# EAGLE design hackathon_trophy (EAGLE 8.3.0)
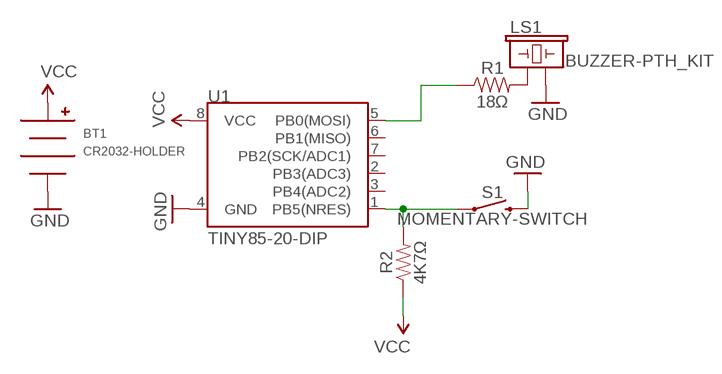
[diagram p0: schematic, sheet 1]

## Parts
BT1  CR2032-HOLDER  [CH28-2032LF]
LS1  BUZZER-PTH_KIT  [BUZZER-12MM-KIT]
R1  18Ω  RESISTOR1206  [1206]
R2  4K7Ω  RESISTOR1206  [1206]
S1  MOMENTARY-SWITCH  MOMENTARY-SWITCH-SPST-PTH-6.0MM-KIT  [TACTILE_SWITCH_PTH_6.0MM_KIT]
U1  TINY85-20-DIP  ATTINY45TINY85-20-DIP  [DIP08_MCU]

## Nets
GND: BT1.NEG LS1.- S1.3 U1.4(GND)
N$3: R2.2 S1.1 U1.1(PB5(NRES))
N$4: LS1.+ R1.2
N$5: R1.1 U1.5(PB0(MOSI))
VCC: BT1.POS R2.1 U1.8(VCC)
Unconnected: U1.2(PB3(ADC3)) U1.3(PB4(ADC2)) U1.6(PB1(MISO)) U1.7(PB2(SCK/ADC1))

## Library data of the parts
BT1 = battery-holder:CR2032-HOLDER
LS1 = SparkFun-Electromechanical:BUZZER: Buzzer Small round buzzers that operate around the audible 2kHz range. You can use these as speakers to create simple music or user interfaces. Variant Overview: PTH - Mini Speaker - PC Mount 12mm 2.048kHz <https://www.sparkfun.com/products/7950> PTH_KIT - Mini Speaker - PC Mount 12mm 2.048kHz <https://www.sparkfun.com/products/7950> KIT simplifies soldering by adding stop mask to one side of the pads. PTH_NO_SILK - Mini Speaker - PC Mount 12mm 2.048kHz <https://www.sparkfun.com/products/7950> No silkscreen indicator of buzzer outline. PTH_KIT_NO_SILK - Mini Speaker - PC Mount 12mm 2.048kHz <https://www.sparkfun.com/products/7950> KIT package w/o silkscreen SMD - Buzzer Audio Magnetic (CCV-084B16) SMD buzzer used on, e.g. the LilyPad Buzzer <https://www.sparkfun.com/products/8463> and RFID USB Reader <https://www.sparkfun.com/products/9963>. SMD_KIT - Buzzer Audio Magnetic (CCV-084B16) SMD Buzzer with elongated pins to make soldering easier. Used on the SparkFun Simon Says - Surface Mount Soldering Kit <https://www.sparkfun.com/products/10935>.; PROD_ID: COMP-08253; SF_SKU: COM-07950
R1 R2 = SparkFun-Resistors:RESISTOR: Generic Resistor Package
S1 = SparkFun-Switches:MOMENTARY-SWITCH-SPST: Momentary Switch (Pushbutton) - SPST Normally-open (NO) SPST momentary switches (buttons, pushbuttons). Variants PTH-12MM - 12mm square, through-hole Momentary Pushbutton Switch - 12mm Square <https://www.sparkfun.com/products/9190> (COM-09190) PTH-6.0MM, PTH-6.0MM-KIT - 6.0mm square, through-hole Mini Pushbutton Switch <https://www.sparkfun.com/products/97> (COM-00097) KIT package intended for soldering kit's - only one side of pads' copper is exposed. PTH-RIGHT-ANGLE-KIT - Right-angle, through-hole Right Angle Tactile Button <https://www.sparkfun.com/products/10791> - Used on SparkFun BigTime Watch Kit <https://www.sparkfun.com/products/11734> SMD-12MM - 12mm square, surface-mount Tactile Button - SMD (12mm) <https://www.sparkfun.com/products/12993> (COM-12993) Used on SparkFun PicoBoard <https://www.sparkfun.com/products/11888> SMD-4.5MM - 4.5mm Square Trackball Switch Used on SparkFun Blackberry Trackballer Breakout <https://www.sparkfun.com/products/13169> SMD-4.6MMX2.8MM - 4.60mm x 2.80mm, surface mount Used on SparkFun SAMD21 Mini Breakout <https://www.sparkfun.com/products/13664> SMD-5.2MM, SMD-5.2-REDUNDANT - 5.2mm square, surface-mount Mini Pushbutton Switch - SMD <https://www.sparkfun.com/products/8720> (COM-08720) Used on Arduino Pro Mini <https://www.sparkfun.com/products/11114> REDUNDANT package connects both switch circuits together SMD-6.0X3.5MM - 6.0 x 3.5mm, surface mount Momentary Reset Switch SMD <https://www.sparkfun.com/products/8229> (COM-08229) SMD-6.2MM-TALL - 6.2mm square, surface mount Tactile Button - SMD (6mm) <https://www.sparkfun.com/products/12992> Used on SparkFun Digital Sandbox <https://www.sparkfun.com/products/12651> SMD-RIGHT-ANGLE - Right-angle, surface mount Used on SparkFun Block for Intel® Edison - Arduino <https://www.sparkfun.com/products/13036>; PROD_ID: SWCH-08441; SF_SKU: COM-00097
U1 = SparkFun-Retired:ATTINY45: Atmel 8-pin 2/4/8kB flash uC Retired; PROD_ID: IC-09445

## Board
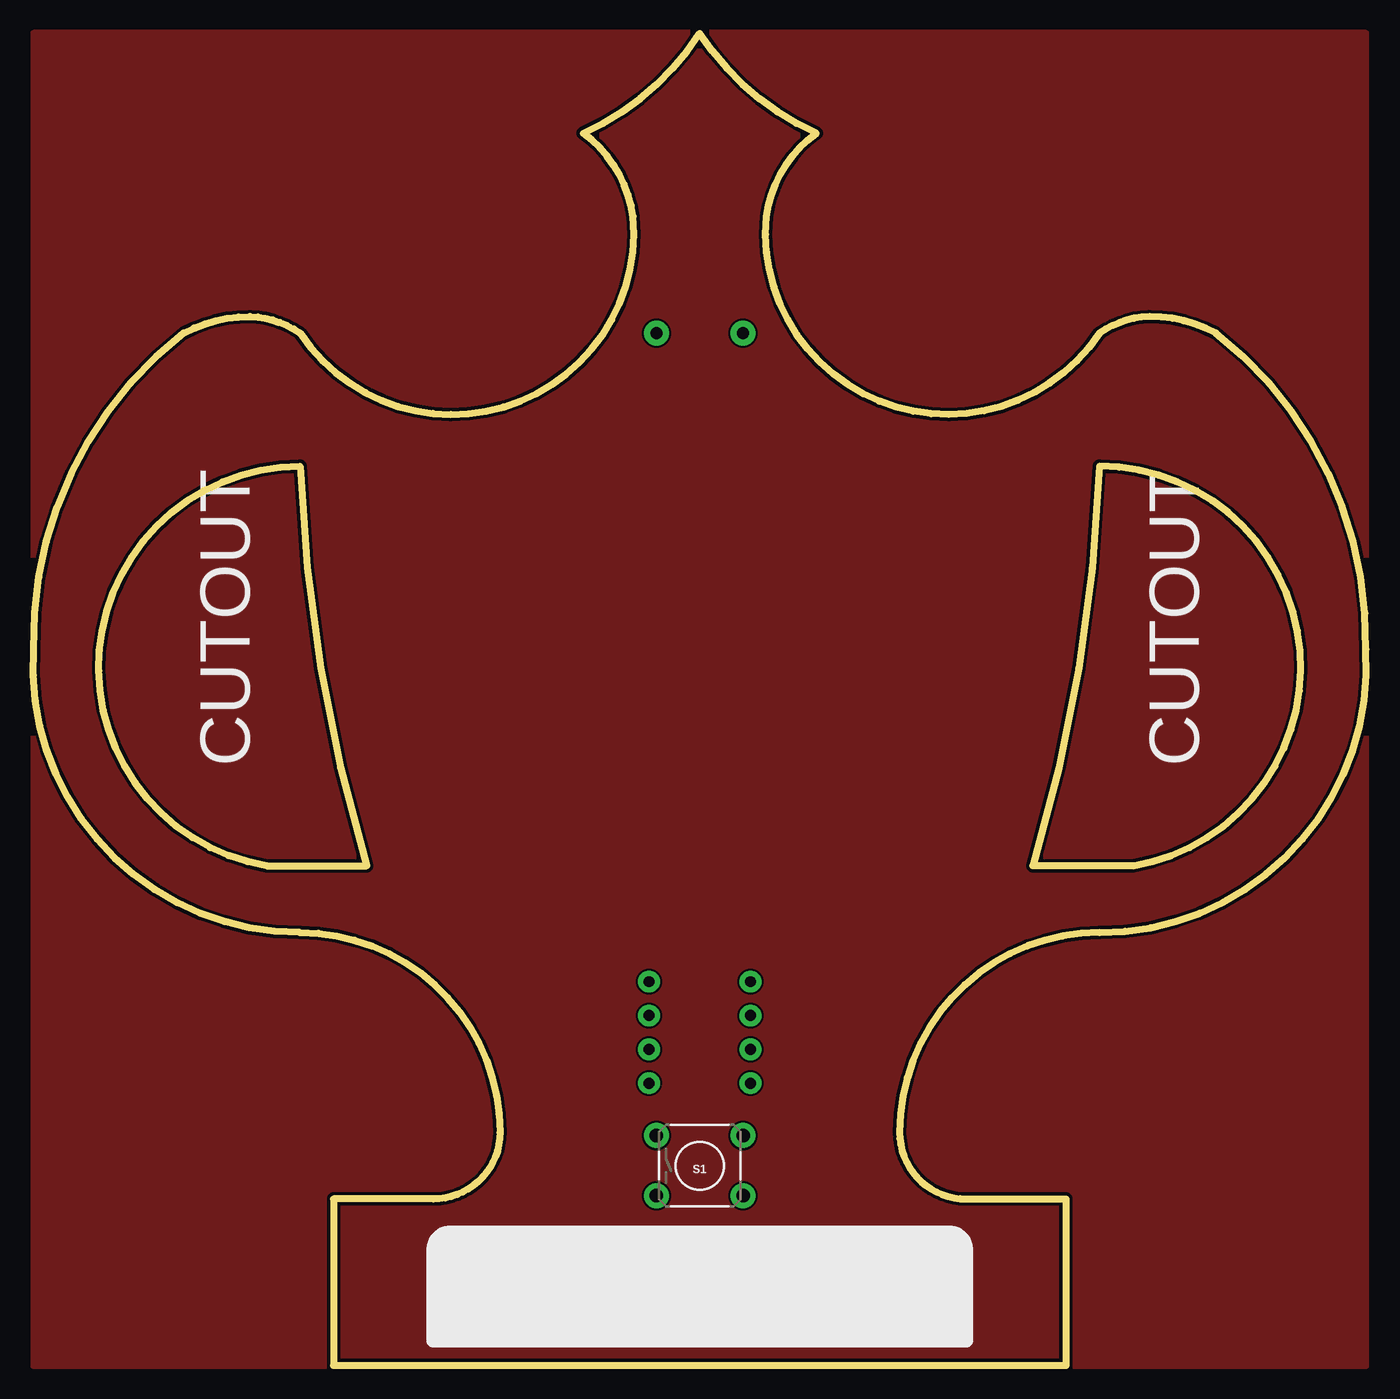
[diagram p1: board, top side]
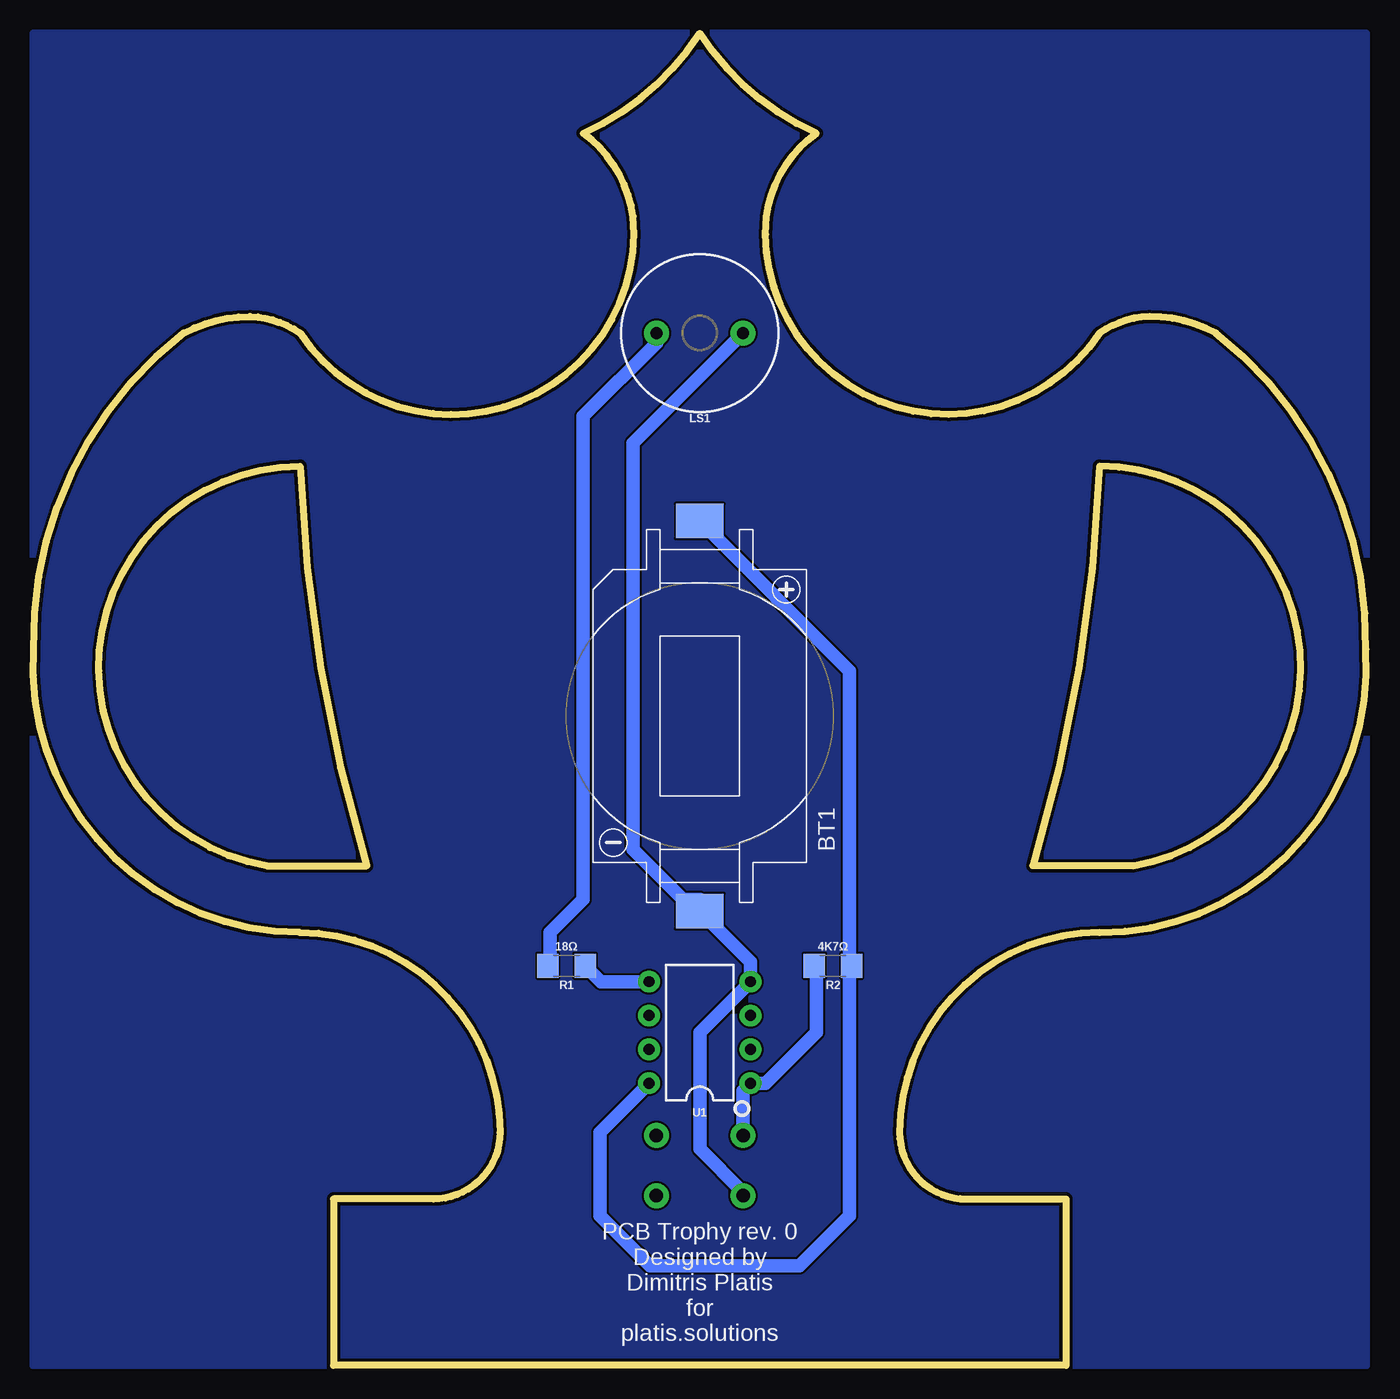
[diagram p2: board, bottom side, seen from below]

Size 100.05 x 100 mm. Coordinates in mm from the lower left corner, seen from the top.
Outline: 65.03,17.5 arc90 70.03,12.5 77.53,12.5 77.53,0 22.53,0 22.53,12.5 30.03,12.5 arc90 35.03,17.5 arc90 20.03,32.5 arc-94 0.03,53.75 arc-53 11.28,77.5 arc-28 16.28,78.75 arc-33 20.03,77.5 arc152 45.03,86.25 arc46 41.28,92.5 arc33 50.03,100 arc33 58.78,92.5 arc46 55.03,86.25 arc152 80.03,77.5 arc-33 83.78,78.75 arc-28 88.78,77.5 arc-53 100.03,53.75 arc-94 80.03,32.5 arc90 65.03,17.5
Outline: 80.03,67.5 arc-15 75.03,37.5 82.53,37.5 arc171 80.03,67.5
Outline: 20.03,67.5 arc15 25.03,37.5 17.53,37.5 arc-171 20.03,67.5
Copper layers (1*16): Top 0.035mm / dielectric 1.5mm / Bottom 0.035mm
Design rules "SeeedStudio_2layer_DRU_edited": minimum track width 7mil, minimum drill 15mil, track to track 6mil, track to pad 6mil, pad to pad 6mil, via to via 6mil, smd to smd 0mil, copper to edge 10mil, drill to drill 10mil, minimum pad ring 10mil, minimum via ring 6mil, stop-mask expansion 2mil, vias tented up to drill 100mil, thermal gap 10mil
Milling: 6 lines

### Footprints (pad centres in the part's own frame; a part is rotated, then mirrored left to right if it is on the bottom)
CH28-2032LF = smd 3.6 x 2.6: NEG 0,-14.65; POS 0,14.65
BUZZER-12MM-KIT = drill 0.9 pad 1.88: + 3.25,0; - -3.25,0
1206 = smd 1.6 x 1.8: 1 -1.4,0; 2 1.4,0
TACTILE_SWITCH_PTH_6.0MM_KIT = drill 1.016 pad 1.88: 1 -3.251,2.261; 2 3.251,2.261; 3 -3.251,-2.261; 4 3.251,-2.261
DIP08_MCU = drill 0.813 pad 1.626: 1 -3.81,-3.81; 2 -1.27,-3.81; 3 1.27,-3.81; 4 3.81,-3.81; 5 3.81,3.81; 6 1.27,3.81; 7 -1.27,3.81; 8 -3.81,3.81

### Placement (x,y rotation side)
BT1  50.03,48.75 0 bottom
LS1  50.03,77.5 180 bottom
R1  60.03,30 180 bottom
R2  40.03,30 180 bottom
S1  50.03,15 0 top
U1  50.03,25 90 bottom

### Tracks (layer width: path | path; a pad name or v marks a point on that pad's centre or on a via)
GND
  Bottom 1.016: S1.3 46.77,13 50.03,16.25 50.03,25 U1.4 46.22,30.29 49.63,33.7 | 49.63,33.7 BT1.NEG | LS1.- 55.03,69.25 55.03,38.75 51.28,35 50.03,35 49.63,34.61 49.63,33.7
N$1
  pour Top: 100.03,100 0.03,100 0.03,0 100.03,0
N$2
  pour Bottom: 100.03,100 0.03,100 0.03,0 100.03,0
N$3
  Bottom 1.016: S1.1 46.77,20.63 U1.1 45.09,21.19 41.28,25 41.28,29.85 R2.2
N$4
  Bottom 1.016: LS1.+ 53.28,76.75 58.78,71.25 58.78,35 61.28,32.5 61.28,30.15 R1.2
N$5
  Bottom 1.016: U1.5 57.44,28.81 R1.1
VCC
  Bottom 1.016: U1.8 57.53,17.5 57.53,11.25 53.78,7.5 42.53,7.5 38.78,11.25 38.78,29.85 | 38.78,29.85 R2.1 | BT1.POS 38.78,52.15 38.78,29.85

### Text on the board
tPlace: CUTOUT | CUTOUT
bPlace: PCB Trophy rev. 0 / Designed by / Dimitris Platis / for / platis.solutions
tStop: Hackathon / 1st prize / WINNER
tRestrict: #1
bRestrict: #1